# EAGLE design Charger Relay Board rev1 (EAGLE 9.1.3)
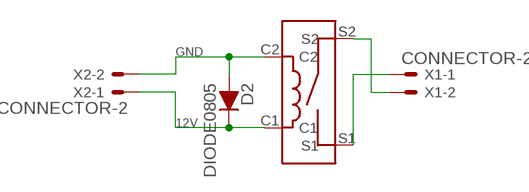
[diagram p0: schematic, sheet 1]

## Parts
D2  DIODE0805  [0805_D]
U$1  KT12-1A-40L-THT  [KT12-1A-40L-THT]
X1  CONNECTOR-2  [MINIFIT_5566-2]
X2  CONNECTOR-2  [MINIFIT_5566-2]

## Nets
12V: D2.C U$1.C1 X2.1
GND: D2.A U$1.C2 X2.2
N$3: U$1.S2 X1.2
N$4: U$1.S1 X1.1

## Library data of the parts
D2 = HyTechDevices:DIODE: DIODE general purpose rectifier
U$1 = HyTechDevices:KT12-1A-40L-THT
X1 X2 = HyTechDevices:CONNECTOR-2: Mini-Fit Junior connector 2 pole Source: http://www.molex.com; OC_FARNELL: 1822072; OC_NEWARK: unknown

## Board
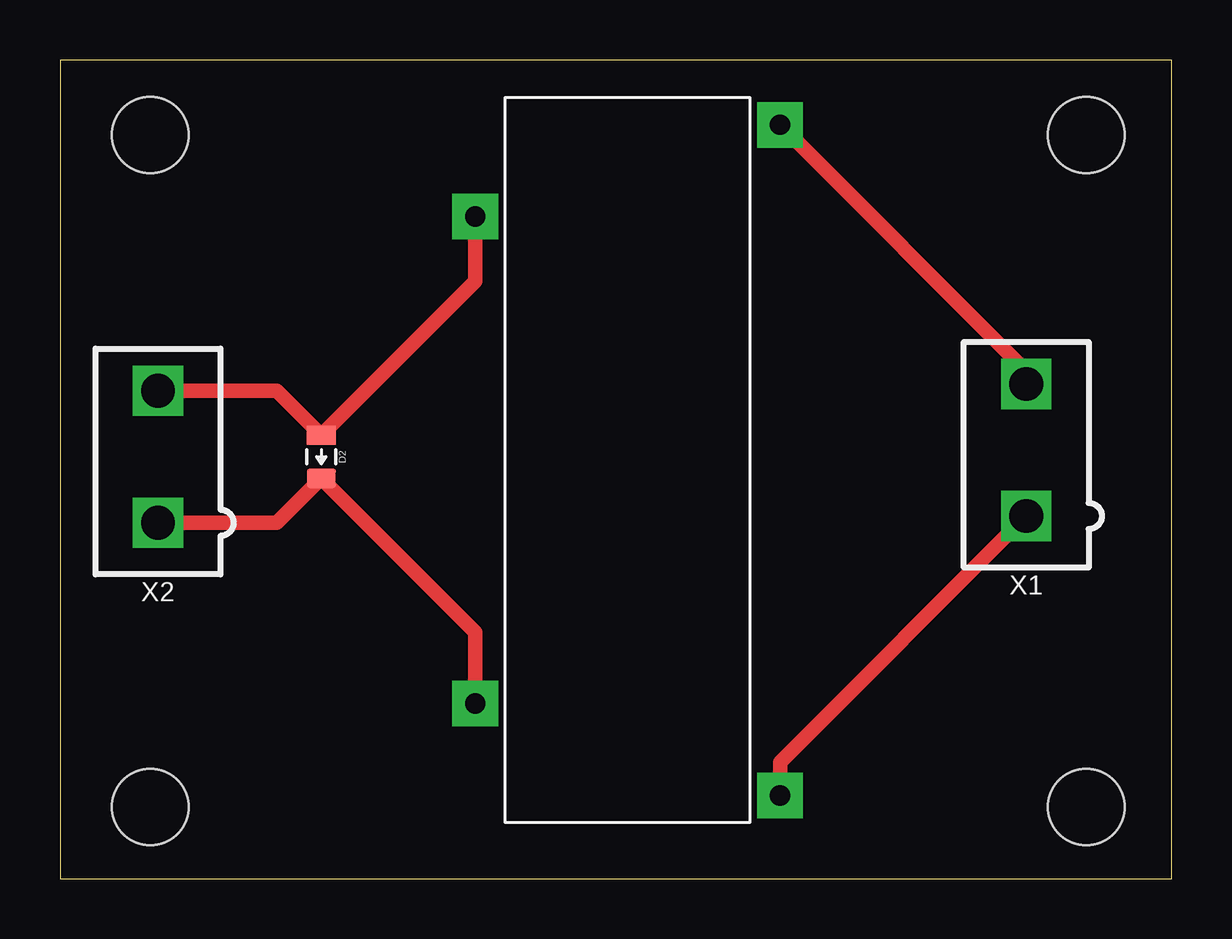
[diagram p1: board, top side]

Size 46.32 x 34.12 mm. Coordinates in mm from the lower left corner, seen from the top.
Outline: 0,0 46.32,0 46.32,34.12 0,34.12 0,0
Copper layers (1*16): Top 0.035mm / dielectric 1.5mm / Bottom 0.035mm
Design rules "DRC Advanced Circuits": minimum track width 6mil, minimum drill 10mil, track to track 6mil, track to pad 6mil, pad to pad 6mil, via to via 6mil, smd to smd 6mil, copper to edge 40mil, drill to drill 6mil, minimum pad ring 10mil, minimum via ring 8mil, stop-mask expansion 4mil, vias tented up to drill 0mil, thermal gap 10mil
Holes 3.17 mm at 3.76,31 3.76,3 42.76,3 42.76,31

### Footprints (pad centres in the part's own frame; a part is rotated, then mirrored left to right if it is on the bottom)
0805_D = smd 0.8 x 1.2: A -0.9,0; C 0.9,0
KT12-1A-40L-THT = drill 0.85 pad 1.9 square: C1 4.95,11.45; C2 25.25,11.45; S1 1.13,-1.25; S2 29.07,-1.25
MINIFIT_5566-2 = drill 1.4 square: 1 0,-2.75; 2 0,2.75

### Placement (x,y rotation side)
D2  10.89,17.59 270 top
U$1  28.75,2.35 90 top
X1  40.26,17.87 0 top
X2  4.08,17.59 0 top

### Tracks (layer width: path | path; a pad name or v marks a point on that pad's centre or on a via)
12V
  Top 0.61: X2.1 9.04,14.84 D2.C 17.3,10.28 U$1.C1
GND
  Top 0.61: X2.2 9.04,20.34 D2.A 17.3,24.9 U$1.C2
N$3
  Top 0.61: U$1.S2 40.26,21.16 X1.2
N$4
  Top 0.61: X1.1 30,4.86 U$1.S1

### Text on the board
tDocu: CONTROL | SWITCHED | HyTech Racing 2019 Charger Relay Board Rev1